# EAGLE design Lodi Mult PCB v002 (EAGLE 8.1.1)
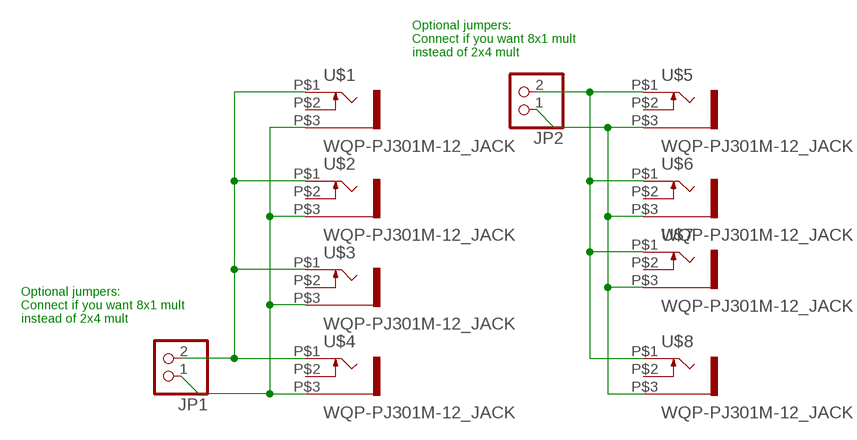
[diagram p0: schematic, sheet 1]

## Parts
JP1  PINHD-1X2  [1X02]
JP2  PINHD-1X2  [1X02]
U$1  WQP-PJ301M-12_JACK  [WQP-PJ301M-12_JACK]
U$2  WQP-PJ301M-12_JACK  [WQP-PJ301M-12_JACK]
U$3  WQP-PJ301M-12_JACK  [WQP-PJ301M-12_JACK]
U$4  WQP-PJ301M-12_JACK  [WQP-PJ301M-12_JACK]
U$5  WQP-PJ301M-12_JACK  [WQP-PJ301M-12_JACK]
U$6  WQP-PJ301M-12_JACK  [WQP-PJ301M-12_JACK]
U$7  WQP-PJ301M-12_JACK  [WQP-PJ301M-12_JACK]
U$8  WQP-PJ301M-12_JACK  [WQP-PJ301M-12_JACK]

## Nets
N$1: JP1.2 U$1.P$1 U$2.P$1 U$3.P$1 U$4.P$1
N$2: JP1.1 U$1.P$3 U$2.P$3 U$3.P$3 U$4.P$3
N$3: JP2.2 U$5.P$1 U$6.P$1 U$7.P$1 U$8.P$1
N$4: JP2.1 U$5.P$3 U$6.P$3 U$7.P$3 U$8.P$3
Unconnected: U$1.P$2 U$2.P$2 U$3.P$2 U$4.P$2 U$5.P$2 U$6.P$2 U$7.P$2 U$8.P$2

## Notes on the sheet
- Optional jumpers:
  Connect if you want 8x1 mult
  instead of 2x4 mult
- Optional jumpers:
  Connect if you want 8x1 mult
  instead of 2x4 mult

## Library data of the parts
JP1 JP2 = pinhead:PINHD-1X2: PIN HEADER
U$1-U$8 = thonkiconn:WQP-PJ301M-12_JACK

## Board
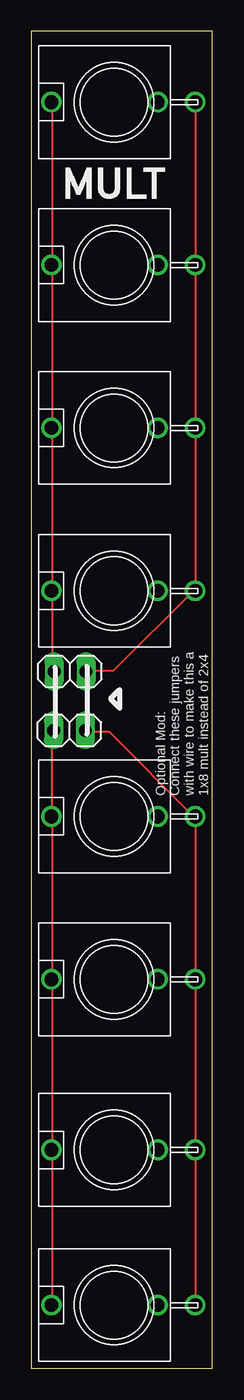
[diagram p1: board, top side]

Size 14.48 x 106.68 mm. Coordinates in mm from the lower left corner, seen from the top.
Outline: 0,0 14.48,0 14.48,106.68 0,106.68 0,0
Copper layers (1*16): Top 0.035mm / dielectric 1.5mm / Bottom 0.035mm
Design rules "Smart Prototyping - NOA Eagle Rule 2016-06-12": minimum track width 6mil, minimum drill 0.3mm, track to track 6mil, track to pad 6mil, pad to pad 6mil, via to via 6mil, smd to smd 0mil, copper to edge 0.4mm, drill to drill 10mil, minimum pad ring 10mil, minimum via ring 6mil, stop-mask expansion 2mil, vias tented up to drill 25mil, thermal gap 10mil

### Footprints (pad centres in the part's own frame; a part is rotated, then mirrored left to right if it is on the bottom)
1X02 = drill 1.016 long: 1 -1.27,0; 2 1.27,0
WQP-PJ301M-12_JACK = drill 1.1: P$1 0,5; P$2 0,-3.5; P$3 0,-6.5

### Placement (x,y rotation side)
JP1  3.09,55.59 180 top
JP2  3.05,50.89 180 top
U$1  6.6,101.03 90 top
U$2  6.6,88.03 90 top
U$3  6.6,75.03 90 top
U$4  6.6,62.03 90 top
U$5  6.6,44.03 90 top
U$6  6.6,31.03 90 top
U$7  6.6,17.42 90 top
U$8  6.6,5.03 90 top

### Tracks (layer width: path | path; a pad name or v marks a point on that pad's centre or on a via)
N$1
  Top 0.152: U$1.P$1 1.68,100.89 1.68,88.09 U$2.P$1 1.68,87.94 1.68,75.13 U$3.P$1 1.68,74.98 1.68,62.18 U$4.P$1 1.68,62.03 1.68,55.63 JP1.2
N$2
  Top 0.152: U$1.P$3 13.11,100.89 13.11,88.09 U$2.P$3 13.11,87.94 13.11,75.13 U$3.P$3 13.11,74.98 13.11,62.18 U$4.P$3 12.95,62.03 6.55,55.63 4.42,55.63 JP1.1
N$3
  Top 0.152: U$8.P$1 1.68,5.18 1.68,17.37 U$7.P$1 1.68,17.53 1.68,30.94 U$6.P$1 1.68,31.09 1.68,43.89 U$5.P$1 1.68,44.04 1.68,50.75 JP2.2
N$4
  Top 0.152: U$8.P$3 13.11,5.18 13.11,17.37 U$7.P$3 13.11,17.53 13.11,30.94 U$6.P$3 13.11,31.09 13.11,43.89 U$5.P$3 12.95,44.04 6.25,50.75 4.42,50.75 JP2.1

### Text on the board
tNames: Optional Mod: / Connect these jumpers / with wire to make this a / 1x8 mult instead of 2x4
bNames: North Coast Modular Collective | v.002 NOV 2017 | Lance motioned with support from Walz to approve the / snow plowing bid from Green Shades Snow Plowing/Lawn / Mowing for $100 per visit at 1.5 - 3 inch depth, overnight / snows over 3 inches and up to 5 inches will be plowed and / salted once at a bid of $160; snow accumulations over 5 / inches requiring multiple plows at the $100/price per plow. / Salt only of parking lot/driveway and clearing only of sidewalks / for 1 inch or less will be $45 per visit. | 42° 12' 20" N, 83° 49' 4" W